# EAGLE design Relay_Shield (EAGLE 8.0.0)
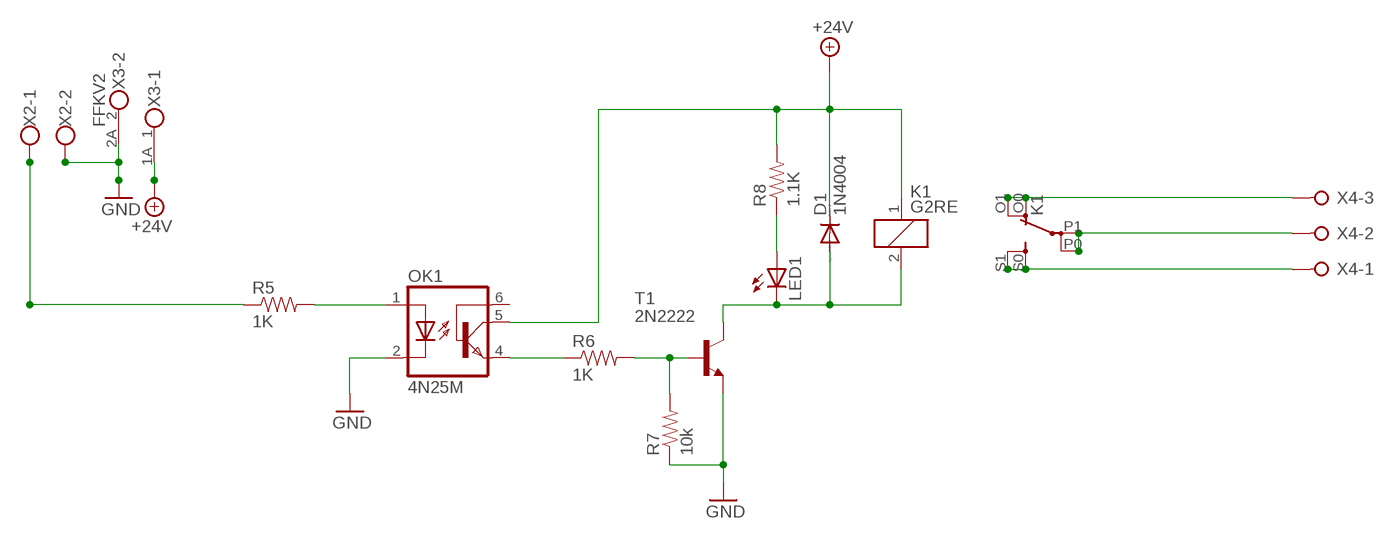
[diagram p0: schematic, sheet 1]

## Parts
D1  1N4004  [DO41-10]
K1  G2RE  [G2RE]
LED1  LED3MM  [LED3MM]
OK1  4N25M  [DIL06]
R5  1K  RESISTOR1206  [1206]
R6  1K  RESISTOR1206  [1206]
R7  10k  RESISTOR1206  [1206]
R8  1.1K  RESISTOR1206  [1206]
T1  2N2222  [TO18]
X2  W237-102  [W237-102]
X3  FFKV2  [FFKV2]
X4  W237-3E  [W237-3E]

## Nets
+24V: D1.C K1.1 OK1.5(COL) R8.2 X3.1A
GND: OK1.2(C) R7.1 T1.1(E) X2.2 X3.2A
N$1: OK1.1(A) R5.2
N$2: OK1.4(EMI) R6.1
N$3: R6.2 R7.2 T1.2(B)
N$4: R5.1 X2.1
N$5: D1.A K1.2 LED1.K(C) T1.3(C)
N$6: LED1.A R8.1
N$8: K1.P0(2:P) K1.P1(2:P) X4.2
N$9: K1.O0(2:O) K1.O1(2:O) X4.3
N$10: K1.S0(2:S) K1.S1(2:S) X4.1
Unconnected: OK1.6(BAS) X3.1 X3.2

## Library data of the parts
D1 = diode:1N4004: DIODE general purpose rectifier, 1 A
K1 = relay:G2RE: RELAY 1 x switch, high current, Omron; OC_FARNELL: unknown; OC_NEWARK: unknown
LED1 = led:LED: LED OSRAM: - CHIPLED LG R971, LG N971, LY N971, LG Q971, LY Q971, LO R971, LY R971 LH N974, LH R974 LS Q976, LO Q976, LY Q976 LO Q996 - Hyper CHIPLED LW Q18S LB Q993, LB Q99A, LB R99A - SideLED LS A670, LO A670, LY A670, LG A670, LP A670 LB A673, LV A673, LT A673, LW A673 LH A674 LY A675 LS A676, LA A676, LO A676, LY A676, LW A676 LS A679, LY A679, LG A679 - Hyper Micro SIDELED® LS Y876, LA Y876, LO Y876, LY Y876 LT Y87S - SmartLED LW L88C, LW L88S LB L89C, LB L89S, LG L890 LS L89K, LO L89K, LY L89K LS L896, LA L896, LO L896, LY L896 - TOPLED LS T670, LO T670, LY T670, LG T670, LP T670 LSG T670, LSP T670, LSY T670, LOP T670, LYG T670 LG T671, LOG T671, LSG T671 LB T673, LV T673, LT T673, LW T673 LH T674 LS T676, LA T676, LO T676, LY T676, LB T676, LH T676, LSB T676, LW T676 LB T67C, LV T67C, LT T67C, LS T67K, LO T67K, LY T67K, LW E67C LS E67B, LA E67B, LO E67B, LY E67B, LB E67C, LV E67C, LT E67C LW T67C LS T679, LY T679, LG T679 LS T770, LO T770, LY T770, LG T770, LP T770 LB T773, LV T773, LT T773, LW T773 LH T774 LS E675, LA E675, LY E675, LS T675 LS T776, LA T776, LO T776, LY T776, LB T776 LHGB T686 LT T68C, LB T68C - Hyper Mini TOPLED® LB M676 - Mini TOPLED Santana® LG M470 LS M47K, LO M47K, LY M47K Source: http://www.osram.convergy.de LUXEON: - LUMILED® LXK2-PW12-R00, LXK2-PW12-S00, LXK2-PW14-U00, LXK2-PW14-V00 LXK2-PM12-R00, LXK2-PM12-S00, LXK2-PM14-U00 LXK2-PE12-Q00, LXK2-PE12-R00, LXK2-PE12-S00, LXK2-PE14-T00, LXK2-PE14-U00 LXK2-PB12-K00, LXK2-PB12-L00, LXK2-PB12-M00, LXK2-PB14-N00, LXK2-PB14-P00, LXK2-PB14-Q00 LXK2-PR12-L00, LXK2-PR12-M00, LXK2-PR14-Q00, LXK2-PR14-R00 LXK2-PD12-Q00, LXK2-PD12-R00, LXK2-PD12-S00 LXK2-PH12-R00, LXK2-PH12-S00 LXK2-PL12-P00, LXK2-PL12-Q00, LXK2-PL12-R00 Source: www.luxeon.com KINGBRIGHT: KA-3528ASYC Source: www.kingbright.com
OK1 = optocoupler:4N*?M: General Purpose 6-Pin Phototransistor Optocouplers Source: http://www.fairchildsemi.com/ds/4N/4N35-M.pdf; MPN: 4N25-M; OC_FARNELL: 1021349; OC_NEWARK: 98K9084
R5-R8 = SparkFun-Passives:RESISTOR: Resistor Basic schematic elements and footprints for 0603, 1206, and PTH resistors.
T1 = transistor-neu-to92:2N2222: NPN TRANSISTOR
X2 = con-wago-500:W237-102: WAGO SCREW CLAMP; MPN: 237-102; OC_FARNELL: unknown; OC_NEWARK: 70K9898
X3 = con-phoenix-508:FFKV2: PHOENIX; OC_FARNELL: unknown; OC_NEWARK: unknown
X4 = con-wago-508:W237-3E: WAGO SREW CLAMP; OC_FARNELL: unknown; OC_NEWARK: unknown

## Board
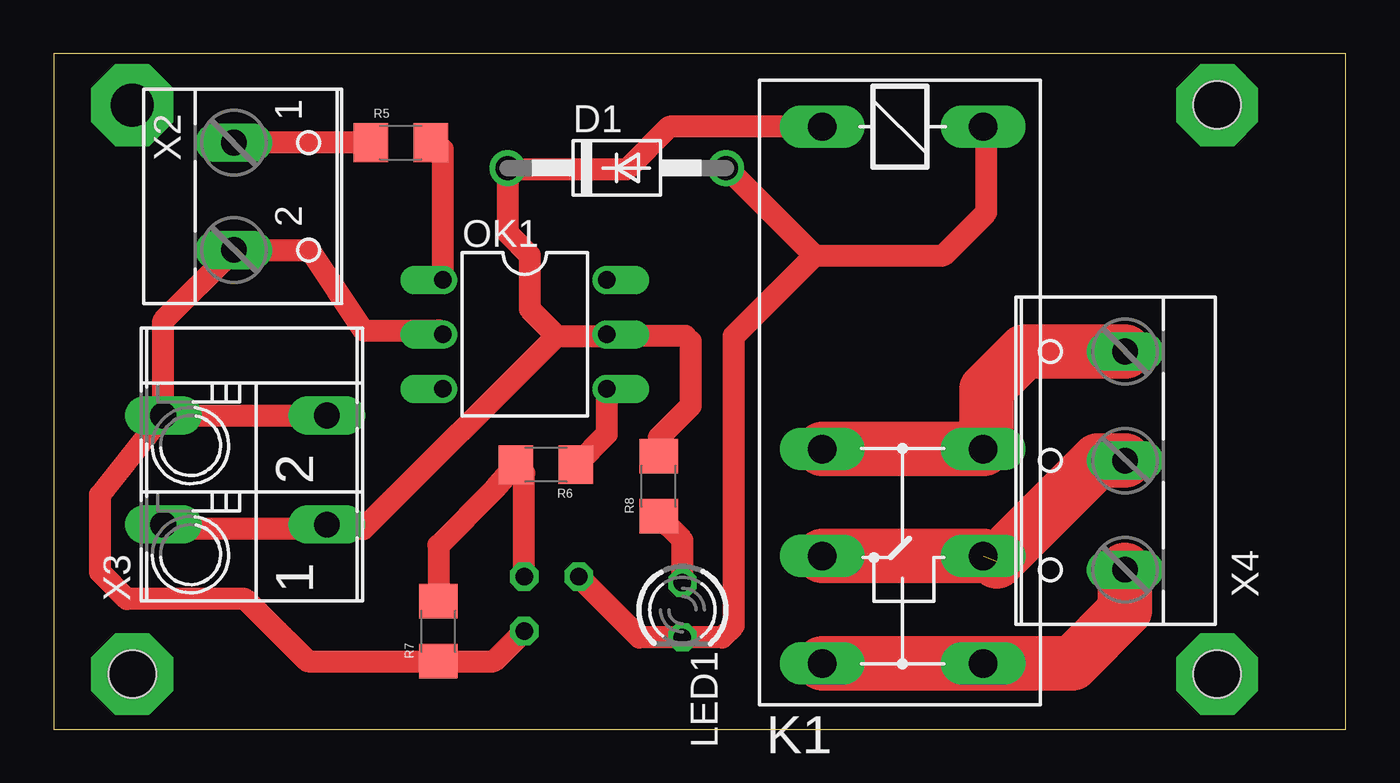
[diagram p1: board, top side]
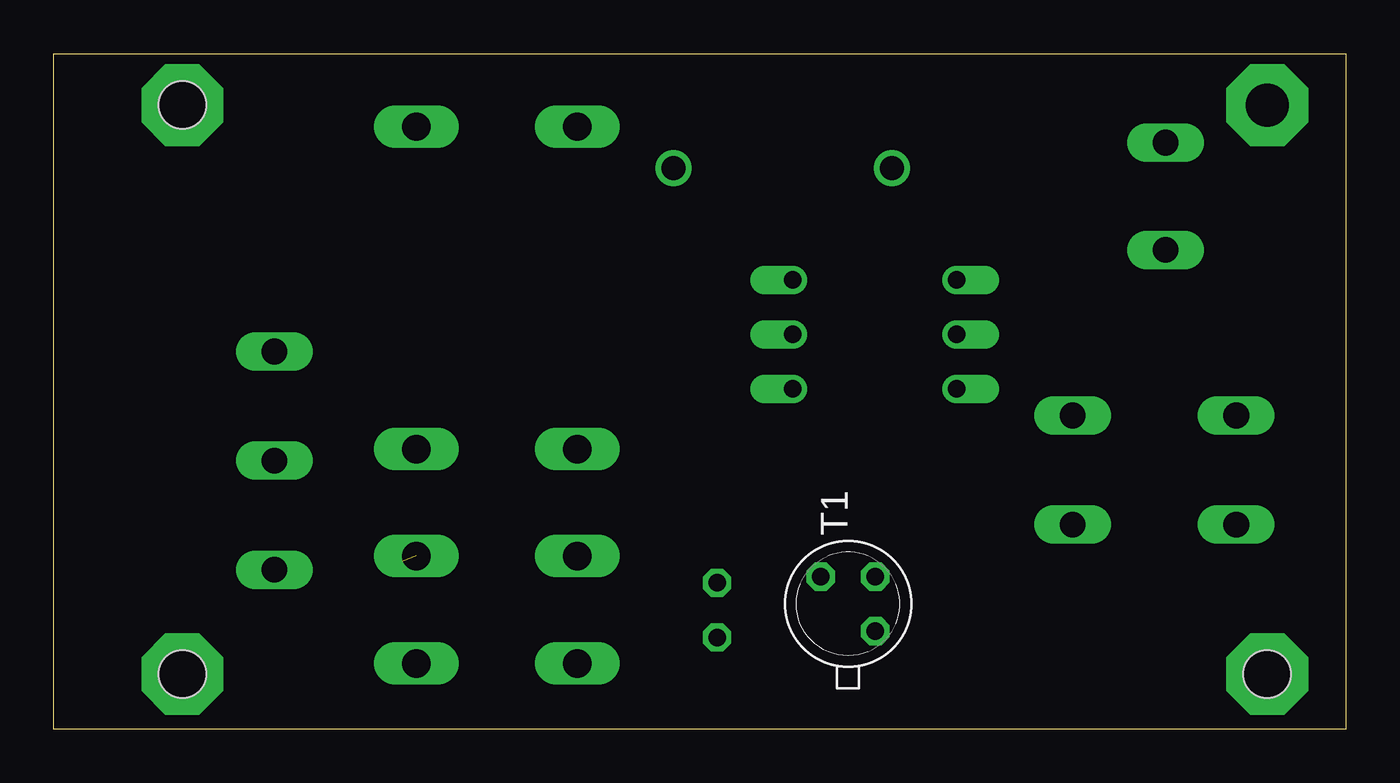
[diagram p2: board, bottom side, seen from below]

Size 60.15 x 31.46 mm. Coordinates in mm from the lower left corner, seen from the top.
Outline: 0,0 60.15,0 60.15,31.46 0,31.46 0,0
Copper layers (1*16): Top 0.035mm / dielectric 1.5mm / Bottom 0.035mm
Design rules "default *": minimum track width 10mil, minimum drill 24mil, track to track 15mil, track to pad 15mil, pad to pad 15mil, via to via 15mil, smd to smd 15mil, copper to edge 40mil, drill to drill 15mil, minimum pad ring 10mil, minimum via ring 8mil, stop-mask expansion 4mil, vias tented up to drill 0mil, thermal gap 10mil
Holes 2.2 mm at 54.16,29.07 54.16,2.57 3.66,2.57

### Footprints (pad centres in the part's own frame; a part is rotated, then mirrored left to right if it is on the bottom)
DO41-10 = drill 1.118: A 5.08,0; C -5.08,0
G2RE = drill 1.321 long: 1 -2.54,-3.683; 2 -2.54,3.81; O0 12.471,-3.683; O1 12.471,3.81; P0 17.45,-3.683; P1 17.45,3.81; S0 22.454,-3.683; S1 22.454,3.81
LED3MM = drill 0.813 octagon: A -1.27,0; K 1.27,0
DIL06 = drill 0.813 offset: 1 -2.54,-3.81; 2 0,-3.81; 3 2.54,-3.81; 4 2.54,3.81; 5 0,3.81; 6 -2.54,3.81
1206 = smd 1.6 x 1.8: 1 -1.4,0; 2 1.4,0
TO18 = drill 0.813 octagon: 1 -1.27,-1.27; 2 1.27,-1.27; 3 1.27,1.27
W237-102 = drill 1.194 long: 1 -2.5,-1.27; 2 2.5,-1.27
FFKV2 = drill 1.194 long: 1 -2.54,-3.81; 1A -2.54,3.81; 2 2.54,-3.81; 2A 2.54,3.81
W237-3E = drill 1.194 long: 1 -5.08,-0.635; 2 0,-0.635; 3 5.08,-0.635

### Placement (x,y rotation side)
D1  26.21,26.14 0 top
K1  39.46,25.52 270 top
LED1  29.27,5.55 270 top
OK1  21.93,18.39 270 top
R5  16.16,27.32 0 top
R6  22.91,12.32 180 top
R7  17.91,4.57 90 top
R8  28.16,11.32 90 top
T1  23.17,5.84 90 bottom
X2  9.66,24.82 270 top
X3  8.91,12.07 90 top
X4  49.24,12.51 90 top

### Tracks (layer width: path | path; a pad name or v marks a point on that pad's centre or on a via)
+24V
  Top 0.61: 35.77,28.07 K1.1 | 25.67,18.32 OK1.5 25.81,18.32 | 5.39,9.32 X3.1A | 29.66,18.07 29.41,18.32
  Top 0.813: R8.2 28.16,13.57 | 21.2,26.07 D1.C
  Top 1.016: D1.C 21.13,23.1 22.16,22.07 22.16,19.57 23.41,18.32 | 23.41,18.32 25.67,18.32 | 23.41,18.32 14.41,9.32 5.39,9.32 | 28.16,13.57 29.66,15.07 29.66,18.07 | 29.41,18.32 25.81,18.32 | K1.1 28.65,28.06 26.66,26.07 21.2,26.07
GND
  Top 1.016: X3.2A 2.16,10.92 2.16,7.32 3.41,6.07 8.91,6.07 11.81,3.17 R7.1 20.5,3.17 T1.1 | OK1.2 17.94,18.57 14.41,18.57 11.91,22.32 X2.2 5.1,19.03 X3.2A | X3.2A 12.91,14.61 12.91,14.57
N$1
  Top 1.016: OK1.1 18.12,27.01 R5.2
N$2
  Top 1.016: OK1.4 25.74,13.75 R6.1
N$3
  Top 0.61: R7.2 18.01,6.07
  Top 0.813: 21.9,11.93 R6.2
  Top 1.016: R6.2 20.51,11.17 17.91,8.57 R7.2 | T1.2 21.9,11.93
N$4
  Top 1.016: R5.1 X2.1
N$5
  Top 0.61: D1.A 31.34,26.14 | 43.41,27.92 K1.2
  Top 1.016: 35.41,22.07 31.34,26.14 | 35.41,22.07 41.41,22.07 43.41,24.07 43.41,27.92 | 35.41,22.07 31.66,18.32 31.66,4.82 31.12,4.28 LED1.K 27.27,4.28 T1.3
N$6
  Top 1.016: LED1.A 29.27,8.81 R8.1
N$7  (via drill 2 pad 3.81)
  other vias: 3.66,29.07
N$8  (1 unrouted)
  Top 2.54: K1.P1 K1.P0 | X4.2 48.6,12.51 43.91,7.82
N$9
  Top 2.54: K1.O0 K1.O1 43.41,13.19 43.41,15.82 45.18,17.59 X4.3
N$10
  Top 2.54: K1.S0 K1.S1 47.41,3.07 49.88,5.54 X4.1
N$11  (via drill 2 pad 3.81)
  other vias: 54.16,29.07
N$12  (via drill 2 pad 3.81)
  other vias: 54.16,2.57
N$13  (via drill 2 pad 3.81)
  other vias: 3.66,2.57